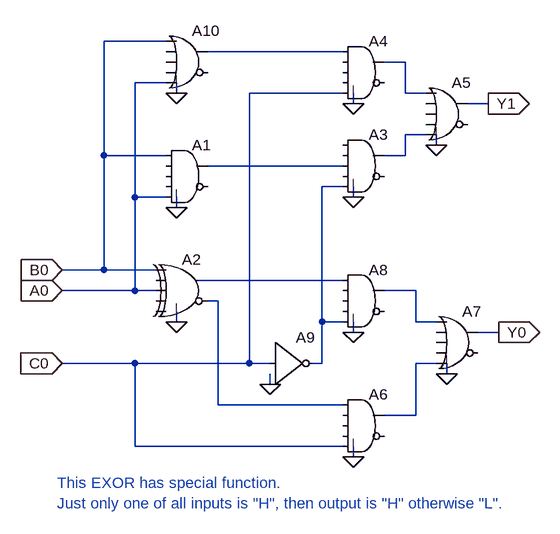
[diagram p0: schematic full_adder.asc]
full_adder.asc, the LTspice schematic file:
Version 4
SHEET 1 1000 936
WIRE 32 -304 -64 -304
WIRE 304 -288 96 -288
WIRE 400 -272 368 -272
WIRE 32 -240 -16 -240
WIRE 48 -224 48 -240
WIRE 304 -224 160 -224
WIRE 400 -224 400 -272
WIRE 432 -224 400 -224
WIRE 320 -208 320 -224
WIRE 528 -208 496 -208
WIRE 432 -160 400 -160
WIRE 448 -144 448 -160
WIRE -64 -128 -64 -304
WIRE 32 -128 -64 -128
WIRE 400 -128 400 -160
WIRE 400 -128 368 -128
WIRE 304 -112 96 -112
WIRE 304 -80 272 -80
WIRE -16 -64 -16 -240
WIRE 32 -64 -16 -64
WIRE 320 -64 320 -80
WIRE 48 -48 48 -64
WIRE -64 48 -64 -128
WIRE -64 48 -128 48
WIRE 16 48 -64 48
WIRE 304 64 80 64
WIRE -16 80 -16 -64
WIRE -16 80 -128 80
WIRE 16 80 -16 80
WIRE 416 80 368 80
WIRE 112 96 96 96
WIRE 48 128 48 112
WIRE 272 128 272 -80
WIRE 304 128 272 128
WIRE 416 128 416 80
WIRE 448 128 416 128
WIRE 320 144 320 128
WIRE 544 144 512 144
WIRE -16 192 -128 192
WIRE 160 192 160 -224
WIRE 160 192 -16 192
WIRE 192 192 160 192
WIRE 272 192 272 128
WIRE 272 192 256 192
WIRE 448 192 416 192
WIRE 464 208 464 192
WIRE 192 224 192 208
WIRE 112 256 112 96
WIRE 304 256 112 256
WIRE 416 272 416 192
WIRE 416 272 368 272
WIRE -16 320 -16 192
WIRE 304 320 -16 320
WIRE 320 336 320 320
FLAG 48 -48 0
FLAG 48 128 0
FLAG -128 80 A0
IOPIN -128 80 In
FLAG -128 48 B0
IOPIN -128 48 In
FLAG 544 144 Y0
IOPIN 544 144 Out
FLAG 528 -208 Y1
IOPIN 528 -208 Out
FLAG -128 192 C0
IOPIN -128 192 In
FLAG 320 -64 0
FLAG 320 -208 0
FLAG 448 -144 0
FLAG 320 336 0
FLAG 464 208 0
FLAG 320 144 0
FLAG 192 224 0
FLAG 48 -224 0
SYMBOL Digital\\and 64 -160 R0
SYMATTR InstName A1
SYMBOL Digital\\xor 64 16 R0
SYMATTR InstName A2
SYMBOL Digital\\and 336 -176 R0
SYMATTR InstName A3
SYMBOL Digital\\and 336 -320 R0
SYMATTR InstName A4
SYMBOL Digital\\or 464 -256 R0
SYMATTR InstName A5
SYMBOL Digital\\and 336 224 R0
SYMATTR InstName A6
SYMBOL Digital\\or 480 96 R0
SYMATTR InstName A7
SYMBOL Digital\\and 336 32 R0
SYMATTR InstName A8
SYMBOL Digital\\inv 192 128 R0
SYMATTR InstName A9
SYMBOL Digital\\or 64 -336 R0
SYMATTR InstName A10
TEXT -136 376 Left 2 ;This EXOR has special function.\nJust only one of all inputs is "H", then output is "H" otherwise "L".

The netlist it stands for:
* full_adder.asc
A1 B0 0 0 0 A0 0 N004 0 AND
A2 B0 0 A0 0 0 N008 N006 0 XOR
A3 0 0 N004 0 N005 0 N003 0 AND
A4 N001 0 0 0 C0 0 N002 0 AND
A5 N002 0 0 0 N003 0 Y1 0 OR
A6 N008 0 0 0 C0 0 N009 0 AND
A7 N007 0 0 0 N009 0 Y0 0 OR
A8 N006 0 0 0 N005 0 N007 0 AND
A9 C0 0 0 0 0 N005 0 0 BUF
A10 B0 0 0 0 A0 0 N001 0 OR
* This EXOR has special function.
* Just only one of all inputs is "H", then output is "H" otherwise "L".
.backanno
.end